# EasyEDA Pro project ProPrj_STM32G431 FOC_2026-07-29.epro, schematic Schematic1
Assembly Variant: Basic; Board Name: Board1; Create Date: 2026-06-18; Page Name: P1; Project Name: STM32G431 FOC; Schematic Name: Schematic1; Update Date: 2026-06-18; Company: 嘉立创EDA; Page Size: A4; Version: V1.0
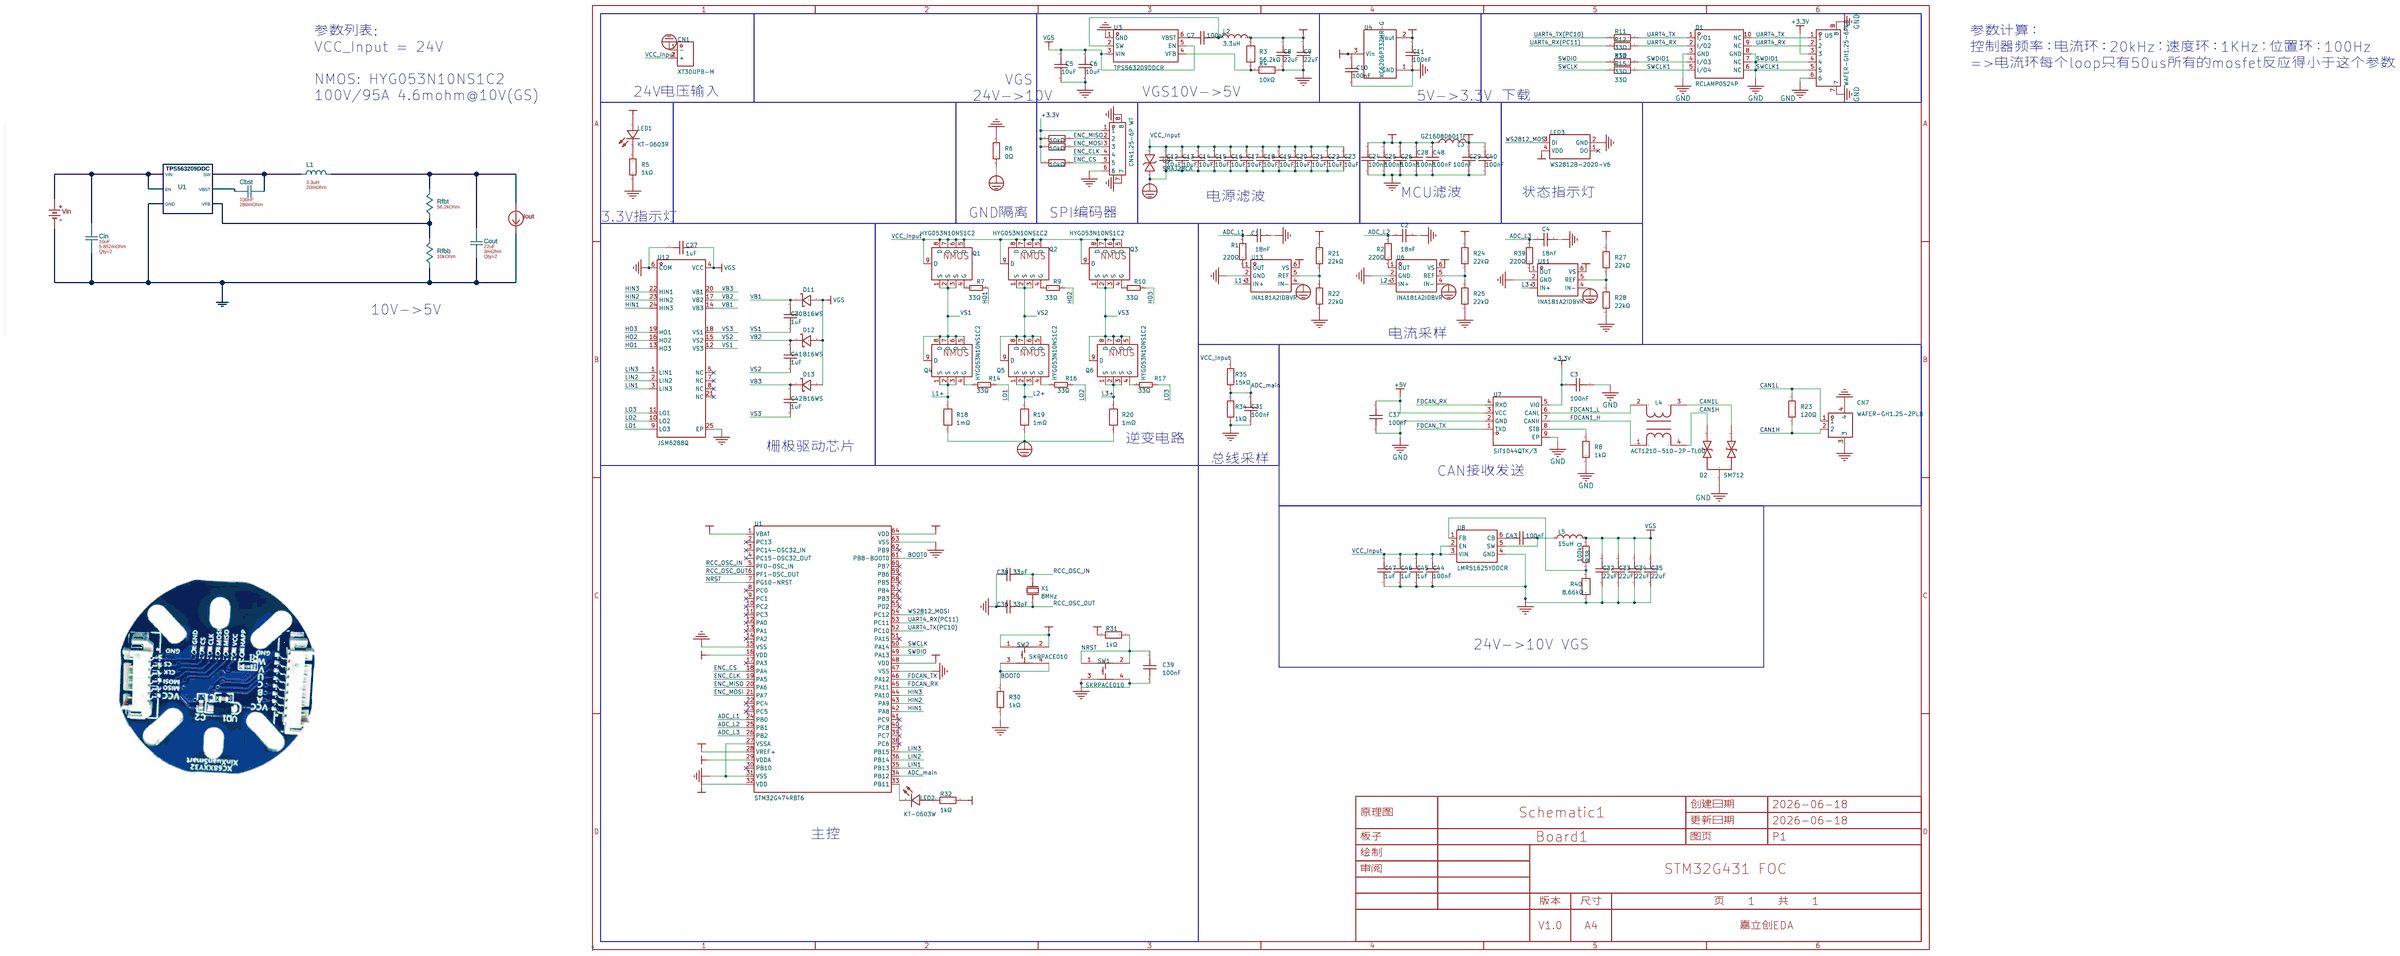
[diagram p0: schematic sheet]

## Parts
C1  18nF  [C0603]
C2  18nF  [C0603]
C3  100nF  [C0603]
C4  18nF  [C0603]
C5  10uF  [C0603]
C6  10uF  [C0603]
C7  100nF  [C0603]
C8  22uF  [C0603]
C9  22uF  [C0603]
C10  100nF  [C0603]
C11  100nF  [C0603]
C12  10uF  [C1206]
C13  10uF  [C1206]
C14  10uF  [C1206]
C15  10uF  [C1206]
C16  10uF  [C1206]
C17  10uF  [C1206]
C18  10uF  [C1206]
C19  10uF  [C1206]
C20  10uF  [C1206]
C21  10uF  [C1206]
C22  10uF  [C1206]
C23  10uF  [C1206]
C24  100nF  [C0603]
C25  100nF  [C0603]
C26  100nF  [C0603]
C27  1uF  [C0603]
C28  100nF  [C0603]
C29  100nF  [C0603]
C30  1uF  [C0603]
C31  100nF  [C0603]
C32  22uF  [C0805]
C33  22uF  [C0805]
C34  22uF  [C0805]
C35  22uF  [C0805]
C36  33pF  [C0603]
C37  100nF  [C0603]
C38  33pF  [C0603]
C39  100nF  [C0603]
C40  100nF  [C0603]
C41  1uF  [C0603]
C42  1uF  [C0603]
C43  100nF  [C0603]
C44  100nF  [C0603]
C45  1uF  [C0603]
C46  1uF  [C0603]
C47  1uF  [C0603]
C48  100nF  [C0603]
CN1  XT30UPB-M  [CONN-TH_XT30UPB-M]
CN4  1.25-6P WT  [CONN-SMD_1.25-6PWT]
CN7  WAFER-GH1.25-2PLB  [CONN-TH_2P-P1.25_XUNPU_WAFER-GH1.25-2PLB]
D1  RCLAMP0524P  [DFN2510-10_L2.5-W1.0-P0.50-BL]
D2  SM712  [SOT-23-3_L2.9-W1.3-P1.90-LS2.4-BR]
D11  B16WS  [SOD-323_L1.8-W1.3-LS2.5-RD]
D12  B16WS  [SOD-323_L1.8-W1.3-LS2.5-RD]
D13  B16WS  [SOD-323_L1.8-W1.3-LS2.5-RD]
L2  3.3uH  [IND-SMD_L4.4-W4.2_SPM4020T]
L3  GZ1608D601TF  [L0603]
L4  ACT1210-510-2P-TL00  [FILTER-SMD_4P-L3.2-W2.5-BL_ACT1210]
L5  15uH  [IND-SMD_L5.7-W5.2_GSM0530]
LED1  KT-0603R  [LED-SMD_L1.6-W0.8-R-RD]
LED2  KT-0603W  [LED0603-R-RD_WHITE]
LED3  WS2812B-2020-V6  [LED-SMD_4P-L2.2-W2.0-P1.00_WS2815C-2020-4P]
Q1  HYG053N10NS1C2  [PDFN-8_L5.8-W5.0-P1.27-LS6.2-BL]
Q2  HYG053N10NS1C2  [PDFN-8_L5.8-W5.0-P1.27-LS6.2-BL]
Q3  HYG053N10NS1C2  [PDFN-8_L5.8-W5.0-P1.27-LS6.2-BL]
Q4  HYG053N10NS1C2  [PDFN-8_L5.8-W5.0-P1.27-LS6.2-BL]
Q5  HYG053N10NS1C2  [PDFN-8_L5.8-W5.0-P1.27-LS6.2-BL]
Q6  HYG053N10NS1C2  [PDFN-8_L5.8-W5.0-P1.27-LS6.2-BL]
R1  220Ω  [R0603]
R2  220Ω  [R0603]
R3  56.2kΩ  [R0603]
R4  10kΩ  [R0603]
R5  1kΩ  [R0603]
R6  0Ω  [R0805]
R7  33Ω  [R0603]
R8  1kΩ  [R0603]
R9  33Ω  [R0603]
R10  33Ω  [R0603]
R11  33Ω  [R0603]
R12  33Ω  [R0603]
R13  33Ω  [R0603]
R14  33Ω  [R0603]
R15  33Ω  [R0603]
R16  33Ω  [R0603]
R17  33Ω  [R0603]
R18  1mΩ  [RES-SMD_L6.3-W3.2_R2512]
R19  1mΩ  [RES-SMD_L6.3-W3.2_R2512]
R20  1mΩ  [RES-SMD_L6.3-W3.2_R2512]
R21  22kΩ  [R0603]
R22  22kΩ  [R0603]
R23  120Ω  [R0603]
R24  22kΩ  [R0603]
R25  22kΩ  [R0603]
R27  22kΩ  [R0603]
R28  22kΩ  [R0603]
R30  1kΩ  [R0603]
R31  1kΩ  [R0603]
R32  1kΩ  [R0603]
R33  10kΩ  [R0603]
R34  1kΩ  [R0603]
R35  15kΩ  [R0603]
R36  10kΩ  [R0603]
R37  10kΩ  [R0603]
R38  100kΩ  [R0603]
R39  220Ω  [R0603]
R40  8.66kΩ  [R0603]
SW1  SKRPACE010  [KEY-SMD_4P-L4.2-W3.2-P2.20-LS4.6]
SW2  SKRPACE010  [KEY-SMD_4P-L4.2-W3.2-P2.20-LS4.6]
U1  STM32G474RBT6  [LQFP-64_L10.0-W10.0-P0.50-LS12.0-BL]
U3  TPS563209DDCR  [SOT-23-6_L2.9-W1.6-P0.95-LS2.8-BR]
U4  XC6206P332MR-G  [SOT-23-3_L2.9-W1.6-P1.90-LS2.8-BR]
U5  WAFER-GH1.25-6PLB  [CONN-SMD_6P-P1.25_XUNPU_WAFER-GH1.25-6PLB]
U6  INA181A2IDBVR  [SOT-23-6_L2.9-W1.6-P0.95-LS2.8-BL]
U7  SIT1044QTK/3  [TDFN-8_L3.0-W3.0-P0.65-BL-EP]
U8  LMR51625YDDCR  [SOT-23-6_L2.9-W1.6-P0.95-LS2.8-BL]
U9  SMAJ28CA  [DO-214AC_L4.3-W2.7-LS5.0-BI]
U11  INA181A2IDBVR  [SOT-23-6_L2.9-W1.6-P0.95-LS2.8-BL]
U12  JSM6288Q  [VQFN-24_L4.0-W4.0-P0.50-TL-EP2.7]
U13  INA181A2IDBVR  [SOT-23-6_L2.9-W1.6-P0.95-LS2.8-BL]
X1  8MHz  [CRYSTAL-SMD_L5.0-W3.2]

## Library data of the parts
C1 C2 C4 = CC0603KRX7R9BB183: 容值:18nF;精度:±10%;额定电压:50V;温度系数:X7R;; LCSC Part Name: 18nF ±10% 50V; Supplier Part: C107079; Manufacturer: YAGEO(国巨); Supplier Footprint: 0603; JLCPCB Part Class: Extended Part; Datasheet: https://item.szlcsc.com/datasheet/CC0603KRX7R9BB183/108295.html; Supplier: LCSC; Tolerance: ±10%; Voltage Rating: 50V; Temperature Coefficient: X7R
C3 C7 C10 C11 C24-C26 C28 C29 C31 C37 C39 C40 C43 C44 C48 = CC0603KRX7R9BB104: 容值:100nF;精度:±10%;额定电压:50V;温度系数:X7R;; LCSC Part Name: 100nF ±10% 50V; Supplier Part: C14663; Manufacturer: YAGEO(国巨); Supplier Footprint: 0603; JLCPCB Part Class: Basic Part; Datasheet: https://item.szlcsc.com/datasheet/CC0603KRX7R9BB104/15331.html; Supplier: LCSC; Tolerance: ±10%; Voltage Rating: 50V; Temperature Coefficient: X7R
C5 C6 = CL10A106MA8NRNC: 容值:10uF;精度:±20%;额定电压:25V;温度系数:X5R;; LCSC Part Name: 10uF ±20% 25V; Supplier Part: C96446; Manufacturer: SAMSUNG(三星); Supplier Footprint: 0603; JLCPCB Part Class: Basic Part; Datasheet: https://item.szlcsc.com/datasheet/CL10A106MA8NRNC/97651.html; Supplier: LCSC; Tolerance: ±20%; Voltage Rating: 25V; Temperature Coefficient: X5R
C8 C9 = CL10A226MQ8NRNC: 容值:22uF;精度:±20%;额定电压:6.3V;温度系数:X5R;; LCSC Part Name: 22uF ±20% 6.3V; Supplier Part: C59461; Manufacturer: SAMSUNG(三星); Supplier Footprint: 0603; JLCPCB Part Class: Basic Part; Datasheet: https://item.szlcsc.com/datasheet/CL10A226MQ8NRNC/60514.html; Supplier: LCSC; Tolerance: ±20%; Voltage Rating: 6.3V; Temperature Coefficient: X5R
C12-C23 = CL31A106KBHNNNE: 容值:10uF;精度:±10%;额定电压:50V;温度系数:X5R;; LCSC Part Name: 10uF ±10% 50V; Supplier Part: C13585; Manufacturer: SAMSUNG(三星); Supplier Footprint: 1206; JLCPCB Part Class: Basic Part; Datasheet: https://item.szlcsc.com/datasheet/CL31A106KBHNNNE/14236.html; Supplier: LCSC; Tolerance: ±10%; Voltage Rating: 50V; Temperature Coefficient: X5R
C27 C30 C41 C42 C45-C47 = CL10A105KB8NNNC: 容值:1uF;精度:±10%;额定电压:50V;温度系数:X5R;; LCSC Part Name: 1uF ±10% 50V; Supplier Part: C15849; Manufacturer: SAMSUNG(三星); Supplier Footprint: 0603; JLCPCB Part Class: Basic Part; Datasheet: https://item.szlcsc.com/datasheet/CL10A105KB8NNNC/16531.html; Supplier: LCSC; Tolerance: ±10%; Voltage Rating: 50V; Temperature Coefficient: X5R
C32-C35 = CGA0805X5R226M250MT: 容值:22uF;精度:±20%;额定电压:25V;温度系数:X5R;; LCSC Part Name: 22uF ±20% 25V; Supplier Part: C6119899; Manufacturer: HRE(芯声); Supplier Footprint: 0805; JLCPCB Part Class: Extended Part; Datasheet: https://item.szlcsc.com/datasheet/CGA0805X5R226M250MT/7062605.html; Supplier: LCSC; Tolerance: ±20%; Voltage Rating: 25V; Temperature Coefficient: X5R
C36 C38 = CL10C330JB8NNNC: 容值:33pF;精度:±5%;额定电压:50V;温度系数:C0G;; LCSC Part Name: 33pF ±5% 50V; Supplier Part: C1663; Manufacturer: SAMSUNG(三星); Supplier Footprint: 0603; JLCPCB Part Class: Basic Part; Datasheet: https://item.szlcsc.com/datasheet/CL10C330JB8NNNC/2015.html; Supplier: LCSC; Tolerance: ±5%; Voltage Rating: 50V; Temperature Coefficient: C0G
CN1 = XT30UPB-M: LCSC Part Name: AMASS(艾迈斯)板载立式 航模锂电池控制器连接器插头 PCB板立式 公头XT30UPB-M.G.Y; Supplier Part: C428721; Manufacturer: AMASS(艾迈斯); JLCPCB Part Class: Extended Part; Datasheet: https://item.szlcsc.com/datasheet/XT30UPB-M/423831.html; Supplier: LCSC; Rated current: 15A; Rated voltage: 500VDC; colour: 黄色; Connector type: 航模插头; contact resistance: 0.65mΩ; interface form: 公头; insulating material: PA; metal material: 镀金
CN4 = 1.25-6P WT: 插针结构:1x6P;间距:1.25mm;安装方式:卧贴;参考系列:PicoBlade(MX 1.25);总PIN数:6P;排数:1;每排PIN数:6;行距:-;额定电流:1A;触头材质:黄铜;触头镀层:锡;工作温度:-25℃~+85℃;; LCSC Part Name: 1.25-6P卧贴编带; Supplier Part: C668617; Manufacturer: SHOU HAN(首韩); Supplier Footprint: SMD,P=1.25mm,卧贴; JLCPCB Part Class: Extended Part; Datasheet: https://item.szlcsc.com/datasheet/1.25-6P%2520WT/698560.html; Supplier: LCSC; Pins Structure: 1x6P; Pitch: 1.25mm; Mounting Type: 卧贴; Reference Series: PicoBlade(MX 1.25); Number of Pins: 6P; Number of Rows: 1; Number of PINs Per Row: 6; Current Rating: 1A; Contact Material: 黄铜; Contact Plating: 锡; Operating Temperature: -25℃~+85℃; Voltage Rating: 125V; Plastic Material: LCP; Flame Retardant Rating: UL94V-0; Color: 米色
CN7 = WAFER-GH1.25-2PLB: 插针结构:1x2P;间距:1.25mm;安装方式:立贴;参考系列:GH;总PIN数:2P;排数:1;每排PIN数:2;额定电流:1A;工作温度范围:-25℃~+85℃;; LCSC Part Name: 1x2P 间距:1.25mm 立贴 系列:GH; Supplier Part: C3029368; Manufacturer: XUNPU(讯普); Supplier Footprint: SMD,P=1.25mm; JLCPCB Part Class: 扩展库; Datasheet: https://atta.szlcsc.com/upload/public/pdf/source/20220527/44F824AAC8C2B617205E15955FF9C23D.pdf; Supplier: LCSC; Pins Structure: 1x2P; Pitch: 1.25mm; Mounting Style: 立贴; Reference Series: GH; Number of Pins: 2P; Number of Rows: 1; Number of PINs Per Row: 2; Current Rating (Max): 1A; Operating Temperature Range: -25℃~+85℃
D1 = RCLAMP0524P_C907837: 极性:单向;反向截止电压(Vrwm):5V;最大钳位电压:17V;峰值脉冲电流(Ipp):4.5A;击穿电压:6.8V;; Supplier Part: C907837; Manufacturer: TECH PUBLIC(台舟); Supplier Footprint: DFN2510-10; JLCPCB Part Class: 扩展库; Datasheet: https://atta.szlcsc.com/upload/public/pdf/source/20210810/AE3DE9AC94AD2A317FD9BEA10653400F.pdf; Supplier: LCSC; polarity: 单向; Reverse Stand-Off Voltage (Vrwm): 5V; Maximum Clamping Voltage: 17V; Peak Pulse Current (Ipp): 4.5A; Breakdown Voltage: 6.8V; Reverse Leakage Current (Ir): 80nA; Number of Lines: 四路; Operating Temperature: -55℃~+125℃; level of protection: IEC 61000-4-2; Type: ESD
D2 = SM712_C521963: 极性:双向;反向截止电压(Vrwm):12V；7V;最大钳位电压:15V；25V;峰值脉冲电流(Ipp):7A;峰值脉冲功率(Ppp):150W;击穿电压:7.5V；13.3V;; Supplier Part: C521963; Manufacturer: TECH PUBLIC(台舟); Supplier Footprint: SOT-23; JLCPCB Part Class: 扩展库; Datasheet: https://atta.szlcsc.com/upload/public/pdf/source/20210810/E76C7C1824B0CB2A5B8963B3ABCE2DCE.pdf; Supplier: LCSC; polarity: 双向; Reverse Stand-Off Voltage (Vrwm): 12V；7V; Maximum Clamping Voltage: 15V；25V; Peak Pulse Current (Ipp): 7A; Peak Pulse Power Dissipation (Ppp): 150W; Breakdown Voltage: 7.5V；13.3V; Reverse Leakage Current (Ir): 500nA；10nA; Number of Lines: 双路; Operating Temperature: -55℃~+125℃; level of protection: IEC 61000-4-2; Type: ESD
D11-D13 = B16WS_C364278: Supplier Part: C364278; Manufacturer: MDD; Supplier Footprint: SOD-323; JLCPCB Part Class: Extended Part; Datasheet: https://atta.szlcsc.com/upload/public/pdf/source/20190125/C364278_08C9E980565605CB111C36D3361AA1D7.pdf; Supplier: LCSC
L2 = PCR0420-3R3-M: 电感值:3.3uH;精度:±20%;额定电流:2.5A;饱和电流(Isat):3.5A;类型:一体成型电感;; LCSC Part Name: 3.3μH ±20% 3.5A; Supplier Part: C53896857; Manufacturer: JIERR(捷而瑞); Supplier Footprint: SMD,4.4x4.1mm; JLCPCB Part Class: Extended Part; Datasheet: https://item.szlcsc.com/datasheet/PCR0420-3R3-M/57092539.html; Supplier: LCSC; Tolerance: ±20%; Current Rating: 2.5A; Current - Saturation(Isat): 3.5A; DC Resistance(DCR): 85mΩ; Type: 一体成型电感
L3 = GZ1608D601TF: 标称阻抗@测试频率:600Ω@100MHz;误差:±25%;直流电阻(RDC):450mΩ;; LCSC Part Name: 单路 0603磁珠 阻抗600Ω@100MHz; Supplier Part: C1002; Manufacturer: Sunlord(顺络); Supplier Footprint: 0603; JLCPCB Part Class: 基础库; Datasheet: https://atta.szlcsc.com/upload/public/pdf/source/20231030/9B6A3E87682CEC1FF6638DFAA81D73FA.pdf; Supplier: LCSC; Impedance @ Frequency: 600Ω@100MHz; Tolerance: ±25%; DC Resistance: 450mΩ; Current Rating: 200mA; Circuits: 1
L4 = ACT1210-510-2P-TL00: 线路数:2;电感 @ 频率:51uH@100kHz;阻抗 @ 频率:2.6kΩ@10MHz;直流电阻(DCR):700mΩ;; LCSC Part Name: 两路 共模滤波器 阻抗2.6kΩ@10MHz; Supplier Part: C95572; Manufacturer: TDK; Supplier Footprint: 3.2x2.5mm; JLCPCB Part Class: 扩展库; Datasheet: https://atta.szlcsc.com/upload/public/pdf/source/20171113/C95572_15105616815011116176.pdf; Supplier: LCSC; Number of Lines: 2; Current Rating: 200mA; Inductance @ Frequency: 51uH@100kHz; Voltage Rating - DC: 80V; Impedance @ Frequency: 2.6kΩ@10MHz; DC Resistance (DCR): 700mΩ; Operating Temperature: -55℃~+150℃
L5 = SRG0530-150-M: 电感值:15uH;精度:±20%;额定电流:2.5A;饱和电流(Isat):3A;类型:一体成型电感;; LCSC Part Name: 15μH ±20% 3A; Supplier Part: C53462979; Manufacturer: JIERR(捷而瑞); Supplier Footprint: SMD,5.7x5.2mm; JLCPCB Part Class: Extended Part; Datasheet: https://item.szlcsc.com/datasheet/SRG0530-150-M/56628174.html; Supplier: LCSC; Tolerance: ±20%; Current Rating: 2.5A; Current - Saturation(Isat): 3A; DC Resistance(DCR): 218mΩ; Type: 一体成型电感
LED1 = KT-0603R: 灯头类型:-;发光颜色:红色;正向压降(Vf):1.8V~2.4V;功率:40mW;正向电流:20mA;波长:615nm~630nm;二极管配置:独立二极管;透镜颜色:无色透明透镜;色温:-;发光强度:300mcd;发光角度:120°;载带方式:-;工作温度:-40℃~+85℃;; LCSC Part Name: 0603 红灯 高亮; Supplier Part: C2286; Manufacturer: KENTO; Supplier Footprint: 0603; JLCPCB Part Class: Basic Part; Datasheet: https://item.szlcsc.com/datasheet/KT-0603R/2659.html; Supplier: LCSC; Illumination Color: 红色; Voltage - Forward(Vf): 1.8V~2.4V; Power(Watts): 40mW; Forward Current: 20mA; Wavelength - Dominant: 615nm~630nm; Peak Wavelength: 645nm; Diode Configuration: 独立二极管; Lens Color: 无色透明透镜; Luminous Intensity: 300mcd; Viewing Angle: 120°; Operating Temperature: -40℃~+85℃
LED2 = KT-0603W: 发光颜色:白色;; LCSC Part Name: 0603 白灯 高亮; Supplier Part: C2290; Manufacturer: KENTO; Supplier Footprint: 0603; JLCPCB Part Class: 基础库; Datasheet: https://atta.szlcsc.com/upload/public/pdf/source/20221101/4C23D5C85BA051E44A00B833D0A41468.pdf; Supplier: LCSC; Emitted Color: 白色
LED3 = WS2812B-2020-V6: Supplier Part: C52917434; Manufacturer: worldsemi; Supplier Footprint: SMD2020-4P; JLCPCB Part Class: Extended Part; Datasheet: https://item.szlcsc.com/datasheet/WS2812B-2020-V6/55827425.html; Supplier: LCSC
Q1-Q6 = HYG053N10NS1C2: 数量:1个N沟道;漏源电压(Vdss):100V;连续漏极电流(Id):95A;导通电阻(RDS(on)):5.3mΩ@10V;耗散功率(Pd):83.3W;阈值电压(Vgs(th)):4V@250uA;; LCSC Part Name: N沟道增强型MOSFET 1个N沟道 耐压:100V 电流:95A; Supplier Part: C2986239; Manufacturer: HUAYI(华羿微); Supplier Footprint: PDFN5x6-8L; JLCPCB Part Class: Extended Part; Datasheet: https://item.szlcsc.com/datasheet/HYG053N10NS1C2/3433327.html; Supplier: LCSC; Number: 1个N沟道; Drain to Source Voltage: 100V; Current - Continuous Drain(Id): 95A; RDS(on): 5.3mΩ@10V; Pd - Power Dissipation: 83.3W; Gate Threshold Voltage (Vgs(th)): 4V@250uA; Gate Charge(Qg): 73nC@10V; Input Capacitance(Ciss): 3.744nF; Reverse Transfer Capacitance (Crss@Vds): 153pF; Operating Temperature: -55℃~+175℃; Type: N沟道; Output Capacitance(Coss): 1.342nF
R1 R2 R39 = 0603WAF2200T5E: 电阻类型:厚膜电阻;阻值:220Ω;精度:±1%;功率:100mW;最大工作电压:75V;温度系数:±100ppm/℃;; LCSC Part Name: 220Ω ±1% 100mW 厚膜电阻; Supplier Part: C22962; Manufacturer: UNI-ROYAL(厚声); Supplier Footprint: 0603; JLCPCB Part Class: Basic Part; Datasheet: https://atta.szlcsc.com/upload/public/pdf/source/20200306/C422600_1E6D84923E4A46A82E41ADD87F860B5C.pdf; Supplier: LCSC; Type: 厚膜电阻; Tolerance: ±1%; Power(Watts): 100mW; Overload Voltage (Max): 75V; Temperature Coefficient: ±100ppm/℃; Operating Temperature Range: -55℃~+155℃
R3 = RT0603BRD0756K2L: 电阻类型:薄膜电阻;阻值:56.2kΩ;精度:±0.1%;功率:100mW;工作电压:75V;温度系数:±25ppm/℃;; LCSC Part Name: 薄膜电阻 56.2kΩ ±0.1% 100mW; Supplier Part: C705784; Manufacturer: YAGEO(国巨); Supplier Footprint: 0603; JLCPCB Part Class: Extended Part; Datasheet: https://item.szlcsc.com/datasheet/RT0603BRD0756K2L/742304.html; Supplier: LCSC; Type: 薄膜电阻; Tolerance: ±0.1%; Power(Watts): 100mW; Voltage-Supply(Max): 75V; Temperature Coefficient: ±25ppm/℃; Operating Temperature: -55℃~+155℃
R4 R33 R36 R37 = 0603WAF1002T5E: 电阻类型:厚膜电阻;阻值:10kΩ;精度:±1%;功率:100mW;工作电压:75V;温度系数:±100ppm/℃;; LCSC Part Name: 厚膜电阻 10kΩ ±1% 100mW; Supplier Part: C25804; Manufacturer: UNI-ROYAL(厚声); Supplier Footprint: 0603; JLCPCB Part Class: Basic Part; Datasheet: https://item.szlcsc.com/datasheet/0603WAF1002T5E/26547.html; Supplier: LCSC; Type: 厚膜电阻; Tolerance: ±1%; Power(Watts): 100mW; Voltage-Supply(Max): 75V; Temperature Coefficient: ±100ppm/℃; Operating Temperature: -55℃~+155℃
R5 R8 R30-R32 R34 = 0603WAF1001T5E: 电阻类型:厚膜电阻;阻值:1kΩ;精度:±1%;功率:100mW;最大工作电压:75V;温度系数:±100ppm/℃;; LCSC Part Name: 1kΩ ±1% 100mW 厚膜电阻; Supplier Part: C21190; Manufacturer: UNI-ROYAL(厚声); Supplier Footprint: 0603; JLCPCB Part Class: Basic Part; Datasheet: https://atta.szlcsc.com/upload/public/pdf/source/20200306/C422600_1E6D84923E4A46A82E41ADD87F860B5C.pdf; Supplier: LCSC; Type: 厚膜电阻; Tolerance: ±1%; Power(Watts): 100mW; Overload Voltage (Max): 75V; Temperature Coefficient: ±100ppm/℃; Operating Temperature Range: -55℃~+155℃
R6 = 0805W8F0000T5E: 电阻类型:厚膜电阻;阻值:0Ω;精度:±1%;功率:125mW;工作电压:150V;温度系数:±800ppm/℃;; LCSC Part Name: 0Ω ±1% 125mW 厚膜电阻; Supplier Part: C17477; Manufacturer: UNI-ROYAL(厚声); Supplier Footprint: 0805; JLCPCB Part Class: Basic Part; Datasheet: https://item.szlcsc.com/datasheet/0805W8F0000T5E/18165.html; Supplier: LCSC; Type: 厚膜电阻; Tolerance: ±1%; Power(Watts): 125mW; Voltage-Supply(Max): 150V; Temperature Coefficient: ±800ppm/℃; Operating Temperature: -55℃~+155℃
R7 R9 R10 R14 R16 R17 = 0603WAF220JT5E: 阻值:22Ω;精度:±1%;功率:100mW;温度系数:±100ppm/℃;电阻类型:厚膜电阻;; LCSC Part Name: 22Ω ±1% 100mW 厚膜电阻; Supplier Part: C23345; Manufacturer: UNI-ROYAL(厚声); Supplier Footprint: 0603; JLCPCB Part Class: Basic Part; Datasheet: https://atta.szlcsc.com/upload/public/pdf/source/20200306/C422600_1E6D84923E4A46A82E41ADD87F860B5C.pdf; Supplier: LCSC; Tolerance: ±1%; Power(Watts): 100mW; Overload Voltage (Max): 75V; Temperature Coefficient: ±100ppm/℃; Type: 厚膜电阻; Operating Temperature Range: -55℃~+155℃; Pin Type: IN; Check: true
R11-R13 R15 = 0603WAF330JT5E: 电阻类型:厚膜电阻;阻值:33Ω;精度:±1%;功率:100mW;工作电压:75V;温度系数:±100ppm/℃;; LCSC Part Name: 33Ω ±1% 100mW 厚膜电阻; Supplier Part: C23140; Manufacturer: UNI-ROYAL(厚声); Supplier Footprint: 0603; JLCPCB Part Class: Basic Part; Datasheet: https://item.szlcsc.com/datasheet/0603WAF330JT5E/23867.html; Supplier: LCSC; Type: 厚膜电阻; Tolerance: ±1%; Power(Watts): 100mW; Voltage-Supply(Max): 75V; Temperature Coefficient: ±100ppm/℃; Operating Temperature: -55℃~+155℃
R18-R20 = RE2512F3R001: 电阻类型:采样电阻；合金电阻;阻值:1mΩ;精度:±1%;功率:3W;温度系数:±50ppm/℃;; LCSC Part Name: 1mΩ 3W 2512 ±1%; Supplier Part: C46961745; Manufacturer: JIERR(捷而瑞); Supplier Footprint: 2512; JLCPCB Part Class: Extended Part; Datasheet: https://item.szlcsc.com/datasheet/RE2512F3R001/49133284.html; Supplier: LCSC; Type: 采样电阻；合金电阻; Tolerance: ±1%; Power(Watts): 3W; Temperature Coefficient: ±50ppm/℃
R21 R22 R24 R25 R27 R28 = 0603WAF2202T5E: 电阻类型:厚膜电阻;阻值:22kΩ;精度:±1%;功率:100mW;工作电压:75V;温度系数:±100ppm/℃;; LCSC Part Name: 22kΩ ±1% 100mW 厚膜电阻; Supplier Part: C31850; Manufacturer: UNI-ROYAL(厚声); Supplier Footprint: 0603; JLCPCB Part Class: Basic Part; Datasheet: https://item.szlcsc.com/datasheet/0603WAF2202T5E/32812.html; Supplier: LCSC; Type: 厚膜电阻; Tolerance: ±1%; Power(Watts): 100mW; Voltage-Supply(Max): 75V; Temperature Coefficient: ±100ppm/℃; Operating Temperature: -55℃~+155℃
R23 = 0603WAF1200T5E: 电阻类型:厚膜电阻;阻值:120Ω;精度:±1%;功率:100mW;工作电压:75V;温度系数:±100ppm/℃;; LCSC Part Name: 120Ω ±1% 100mW 厚膜电阻; Supplier Part: C22787; Manufacturer: UNI-ROYAL(厚声); Supplier Footprint: 0603; JLCPCB Part Class: Basic Part; Datasheet: https://item.szlcsc.com/datasheet/0603WAF1200T5E/23514.html; Supplier: LCSC; Type: 厚膜电阻; Tolerance: ±1%; Power(Watts): 100mW; Voltage-Supply(Max): 75V; Temperature Coefficient: ±100ppm/℃; Operating Temperature: -55℃~+155℃
R35 = 0603WAF1502T5E: 电阻类型:厚膜电阻;阻值:15kΩ;精度:±1%;功率:100mW;工作电压:75V;温度系数:±100ppm/℃;; LCSC Part Name: 15kΩ ±1% 100mW 厚膜电阻; Supplier Part: C22809; Manufacturer: UNI-ROYAL(厚声); Supplier Footprint: 0603; JLCPCB Part Class: Basic Part; Datasheet: https://item.szlcsc.com/datasheet/0603WAF1502T5E/23536.html; Supplier: LCSC; Type: 厚膜电阻; Tolerance: ±1%; Power(Watts): 100mW; Voltage-Supply(Max): 75V; Temperature Coefficient: ±100ppm/℃; Operating Temperature: -55℃~+155℃
R38 = 0603WAF1003T5E: 电阻类型:厚膜电阻;阻值:100kΩ;精度:±1%;功率:100mW;工作电压:75V;温度系数:±100ppm/℃;; LCSC Part Name: 100kΩ ±1% 100mW 厚膜电阻; Supplier Part: C25803; Manufacturer: UNI-ROYAL(厚声); Supplier Footprint: 0603; JLCPCB Part Class: Basic Part; Datasheet: https://item.szlcsc.com/datasheet/0603WAF1003T5E/26546.html; Supplier: LCSC; Type: 厚膜电阻; Tolerance: ±1%; Power(Watts): 100mW; Voltage-Supply(Max): 75V; Temperature Coefficient: ±100ppm/℃; Operating Temperature: -55℃~+155℃
R40 = FRC0603F8661TS: 电阻类型:厚膜电阻;阻值:8.66kΩ;精度:±1%;功率:100mW;工作电压:75V;温度系数:±100ppm/℃;; LCSC Part Name: 8.66kΩ ±1% 100mW 厚膜电阻; Supplier Part: C3000724; Manufacturer: FOJAN(富捷); Supplier Footprint: 0603; JLCPCB Part Class: Extended Part; Supplier: LCSC; Type: 厚膜电阻; Tolerance: ±1%; Power(Watts): 100mW; Voltage-Supply(Max): 75V; Temperature Coefficient: ±100ppm/℃; Operating Temperature: -55℃~+155℃
SW1 SW2 = SKRPACE010: 电路结构:单刀单掷;按钮形状:椭圆形按钮;安装方式:立贴;开关长度:4.2mm;开关宽度:3.2mm;开关高度:2.5mm;触点电流:50mA;额定电压:16V;带灯:-;工作寿命:-;; LCSC Part Name: 4.2*3.2*2.5mm 立贴 轻触开关; Supplier Part: C139797; Manufacturer: ALPSALPINE(阿尔卑斯阿尔派); Supplier Footprint: SMD-4P,4.2x3.2mm; JLCPCB Part Class: Extended Part; Datasheet: https://item.szlcsc.com/datasheet/SKRPACE010/151122.html; Supplier: LCSC; Circuit: 单刀单掷; Actuator Style: 椭圆形按钮; Mounting Type: 立贴; Length: 4.2mm; Width: 3.2mm; Switch Height: 2.5mm; Contact Current: 50mA; Voltage Rating: 16V
U1 = STM32G474RBT6: CPU内核:ARM-M4;CPU最大主频:170MHz;应用领域:-;; LCSC Part Name: 带DSP和FPU的170MHz主流ARM Cortex-M4 MCU，具有128 KB Flash存储器、数学加速器、高分辨率定时器和高模拟电平集成; Supplier Part: C529413; Manufacturer: ST(意法半导体); Supplier Footprint: LQFP-64(10x10); JLCPCB Part Class: Extended Part; Datasheet: https://item.szlcsc.com/datasheet/STM32G474RBT6/549641.html; Supplier: LCSC; CPU Core: ARM-M4; CPU Maximum Speed: 170MHz; Program Storage Size: 128KB; Program Memory Type: FLASH; Number of I/O: 52; ADC (Bit): 12bit; DAC (Bit): 12bit; Voltage - Supply: 1.71V~3.6V
U3 = TPS563209DDCR: 功能类型:降压型;工作电压:4.5V~17V;输出电压:760mV~7V;输出电流:3A;输出类型:可调;; LCSC Part Name: 降压型 3A 4.5V~17V; Supplier Part: C181974; Manufacturer: TI(德州仪器); Supplier Footprint: SOT-23-6; JLCPCB Part Class: Extended Part; Datasheet: https://www.ti.com/cn/lit/gpn/tps563209; Supplier: LCSC; Function: 降压型; Voltage - Supply: 4.5V~17V; Output Voltage: 760mV~7V; Output Current: 3A; Frequency - Switching: 650kHz; Operating Temperature: -40℃~+85℃@(TA); Synchronous Rectifier: 是; Number of Outputs: 1; Topology: 降压式; Quiescent Current: 650uA; Switch tube (built-in/external): 内置; Output Type: 可调; Features: 逐波限流；过流保护；打嗝限流
U4 = XC6206P332MR-G_C5446: 输出类型:固定;工作电压:6V;输出电压:3.3V;输出电流:200mA;电源纹波抑制比(PSRR):-;输出极性:正极;; LCSC Part Name: 3.3V 200mA 6V; Supplier Part: C5446; Manufacturer: TOREX(特瑞仕); Supplier Footprint: SOT-23-3L; JLCPCB Part Class: Basic Part; Datasheet: https://item.szlcsc.com/datasheet/XC6206P332MR-G/5896.html; Supplier: LCSC; Output Type: 固定; Voltage - Supply: 6V; Output Voltage: 3.3V; Output Current: 200mA; standby current: 1uA; Features: 过流保护; Operating Temperature: -40℃~+85℃@(Ta); Output Configuration: 正极; Number of Outputs: 1
U5 = WAFER-GH1.25-6PLB: 插针结构:1x6P;间距:1.25mm;安装方式:立贴;参考系列:GH;总PIN数:6P;排数:1;每排PIN数:6;额定电流:1A;工作温度范围:-25℃~+85℃;; LCSC Part Name: 1x6P 间距:1.25mm 立贴 系列:GH; Supplier Part: C3029372; Manufacturer: XUNPU(讯普); Supplier Footprint: SMD,P=1.25mm; JLCPCB Part Class: 扩展库; Datasheet: https://atta.szlcsc.com/upload/public/pdf/source/20220527/44F824AAC8C2B617205E15955FF9C23D.pdf; Supplier: LCSC; Pins Structure: 1x6P; Pitch: 1.25mm; Mounting Style: 立贴; Reference Series: GH; Number of Pins: 6P; Number of Rows: 1; Number of PINs Per Row: 6; Current Rating (Max): 1A; Operating Temperature Range: -25℃~+85℃
U6 U11 U13 = INA181A2IDBVR: 放大器数:单路;共模电压:-200mV~26V;增益:50V/V;带宽:210kHz;; Supplier Part: C2058784; Manufacturer: TI(德州仪器); Supplier Footprint: SOT-23-6; JLCPCB Part Class: Extended Part; Datasheet: https://www.ti.com/cn/lit/gpn/ina4181; Supplier: LCSC; Number of Channels: 单路; Vcm - Common Mode Voltage: -200mV~26V; Gain: 50V/V; Bandwidth: 210kHz; Ib - Input Bias Current: 6uA; Vos - Input Offset Voltage: 25uV; Operating Temperature: -40℃~+125℃; Differential Voltage: -26V~+26V; Single Supply: 2.7V~5.5V; Quiescent Current: 195uA; Output Current: 8mA; Input Offset Voltage Drift(Vos TC): 1uV/℃; Input Offset Current(Ios): 0.05uA; Slew Rate: 2V/us; Common Mode Rejection Ratio (CMRR): 100dB; Noise density(eN): 40nV/√Hz@1kHz
U7 = SIT1044QTK/3: 类型:CAN-FD收发器;数据速率:5Mbps;; Supplier Part: C5308063; Manufacturer: SIT(芯力特); Supplier Footprint: DFN-8(3x3); JLCPCB Part Class: 扩展库; Datasheet: https://atta.szlcsc.com/upload/public/pdf/source/20241105/7D4F6AF505B38E348F613F026F5787F9.pdf; Supplier: LCSC; Type: CAN-FD收发器; Data Rate: 5Mbps; Supply Voltage: 4.75V~5.25V; Operating Temperature: -40℃~+125℃
U8 = LMR51625YDDCR: 功能类型:降压型;工作电压:4.3V~60V;输出电压:800mV~30V;输出电流:2.5A;输出类型:可调;; LCSC Part Name: 降压型 2.5A 4.3V~60V; Supplier Part: C44991044; Manufacturer: TI(德州仪器); Supplier Footprint: SOT-23-6; JLCPCB Part Class: Extended Part; Datasheet: https://www.ti.com.cn/cn/lit/ds/symlink/lmr51625.pdf; Supplier: LCSC; Function: 降压型; Voltage - Supply: 4.3V~60V; Output Voltage: 800mV~30V; Output Current: 2.5A; Frequency - Switching: 1.1MHz; Operating Temperature: -40℃~+150℃@(TJ); Synchronous Rectifier: 是; Topology: 降压式; Quiescent Current: 29uA; Switch tube (built-in/external): 内置; Output Type: 可调
U9 = SMAJ28CA_C19077546: 极性:双向;反向截止电压(Vrwm):28V;钳位电压:45.4V;峰值脉冲电流(Ipp):8.8A;峰值脉冲功率(Ppp):400W@10/1000us;击穿电压:34.4V;; LCSC Part Name: 双向TVS 28V截止 峰值浪涌电流：8.8A; Supplier Part: C19077546; Manufacturer: R+O(宏嘉诚); Supplier Footprint: DO-214AC(SMA); JLCPCB Part Class: Extended Part; Datasheet: https://item.szlcsc.com/datasheet/SMAJ28CA/20275631.html; Supplier: LCSC; Polarity: 双向; Reverse Stand-Off Voltage (Vrwm): 28V; Clamping Voltage: 45.4V; Peak Pulse Current (Ipp): 8.8A; Peak Pulse Power Dissipation (Ppp): 400W@10/1000us; Voltage - Breakdown: 34.4V; Reverse Leakage Current (Ir): 1uA; Operating Temperature: -55℃~+150℃; level of protection: IEC 61000-4-2; Type: TVS
U12 = JSM6288Q: 驱动配置:高边；低边；三相;负载类型:MOSFET;驱动通道数:-;灌电流(IOL):1.8A;拉电流(IOH):1.5A;工作电压:8V~20V;上升时间(tr):30ns;下降时间(tf):30ns;; LCSC Part Name: 250V三相高低侧功率驱动芯片 高低侧同相 步进/伺服电机、电动工具等兼容FD6288Q.; Supplier Part: C19077370; Manufacturer: JSMSEMI(杰盛微); Supplier Footprint: QFN-24; JLCPCB Part Class: Extended Part; Datasheet: https://item.szlcsc.com/datasheet/JSM6288Q/20275147.html; Supplier: LCSC; Driven Configuration: 高边；低边；三相; Load Type: MOSFET; Current - Output Low(IOL): 1.8A; Current - Output High(IOH): 1.5A; Voltage - Supply: 8V~20V; Rise Time: 30ns; Fall Time: 30ns; Features: 欠压保护(UVP); Operating Temperature: -40℃~+125℃; Quiescent Current(Iq): 230uA
X1 = X50328MSB2GI: 晶振类型:贴片晶振;频率:8MHz;常温频差:±10ppm;负载电容:20pF;频率稳定度:±20ppm;; LCSC Part Name: YSX530GA 8MHZ 2P 5032 20PF ±10PPM -40~85℃ (±20PPM); Supplier Part: C115962; Manufacturer: YXC(扬兴晶振); Supplier Footprint: SMD5032-2P; JLCPCB Part Class: Basic Part; Datasheet: https://item.szlcsc.com/datasheet/X50328MSB2GI/117214.html; Supplier: LCSC; Type: 贴片晶振; Normal temperature Frequency Tolerance: ±10ppm; Load Capacitance: 20pF; Frequency Stability: ±20ppm; Operating Temperature: -40℃~+85℃

## Nets
+3.3V: C3.2 C11.2 C24.2 C25.2 C26.2 C28.2 C48.2 CN4.1 L3.1 LED1.1(A) R21.2 R24.2 R27.2 R31.2 R32.1 R33.1 R36.1 R37.1 SW2.1 SW2.2 U1.1(VBAT) U1.16(VDD) U1.32(VDD) U1.48(VDD) U1.64(VDD) U4.2(Vout) U5.3 U6.6(VS) U7.5(VIO) U11.6(VS) U13.6(VS)
+5V: C8.2 C9.2 C10.2 C37.2 L2.2 LED3.4(VDD) R3.2 U4.3(Vin) U7.3(VCC)
GND: C1.2 C2.2 C3.1 C4.2 C5.1 C6.1 C8.1 C9.1 C10.1 C11.1 C24.1 C25.1 C26.1 C27.1 C28.1 C29.1 C31.1 C32.1 C33.1 C34.2 C35.2 C36.1 C37.1 C38.1 C39.1 C40.1 C44.1 C45.2 C46.2 C47.2 C48.1 CN4.6 CN4.7 CN4.8 CN7.3 CN7.4 D1.3(GND) D1.8(GND) D2.3 LED3.2(GND) R4.1 R5.1 R6.2 R8.2 R22.1 R25.1 R28.1 R30.2 R34.1 R40.1 SW1.3 SW1.4 U1.15(VSS) U1.27(VSSA) U1.31(VSS) U1.47(VSS) U1.63(VSS) U3.1(GND) U4.1(GND) U5.6 U5.7 U5.8 U6.2(GND) U7.2(GND) U7.9(EP) U8.4(GND) U11.2(GND) U12.6(COM) U12.25(EP) U13.2(GND)
PGND: C12.1 C13.1 C14.1 C15.1 C16.1 C17.1 C18.1 C19.1 C20.1 C21.1 C22.1 C23.1 CN1.1(-) R6.1 R18.1 R19.1 R20.1 U6.4(IN-) U9.1 U11.4(IN-) U13.4(IN-)
VCC_Input: C12.2 C13.2 C14.2 C15.2 C16.2 C17.2 C18.2 C19.2 C20.2 C21.2 C22.2 C23.2 C44.2 C45.1 C46.1 C47.1 CN1.2(+) Q1.5(D) Q1.6(D) Q1.7(D) Q1.8(D) Q1.9(D) Q2.5(D) Q2.6(D) Q2.7(D) Q2.8(D) Q2.9(D) Q3.5(D) Q3.6(D) Q3.7(D) Q3.8(D) Q3.9(D) R35.2 U8.2(EN) U8.3(VIN) U9.2
VDDA: C29.2 C40.2 L3.2 U1.28(VREF+) U1.29(VDDA)
ADC_L1: C1.1 R1.2 U1.24(PB0)
ADC_L2: C2.1 R2.1 U1.25(PB1)
ADC_L3: C4.1 R39.2 U1.26(PB2)
ADC_main: C31.2 R34.2 R35.1 U1.34(PB12)
BOOT0: R30.1 SW2.3 SW2.4 U1.61(PB8-BOOT0)
CAN1H: CN7.2 D2.2 L4.4 R23.1
CAN1L: CN7.1 D2.1 L4.3 R23.2
ENC_CLK: CN4.4 U1.19(PA5)
ENC_CS: CN4.5 R37.2 U1.18(PA4)
ENC_MISO: CN4.2 R33.2 U1.20(PA6)
ENC_MOSI: CN4.3 R36.2 U1.21(PA7)
FDCAN1_H: L4.1 U7.7(CANH)
FDCAN1_L: L4.2 U7.6(CANL)
FDCAN_RX: U1.45(PA11) U7.4(RXD)
FDCAN_TX: U1.46(PA12) U7.1(TXD)
HIN1: U1.42(PA8) U12.24(HIN3)
HIN2: U1.43(PA9) U12.23(HIN2)
HIN3: U1.44(PA10) U12.22(HIN1)
HO1: R7.2 U12.13(HO3)
HO2: R9.2 U12.16(HO2)
HO3: R10.2 U12.19(HO1)
L1+: Q4.1(S) Q4.2(S) Q4.3(S) R18.2 U13.3(IN+)
L2+: Q5.1(S) Q5.2(S) Q5.3(S) R19.2 U6.3(IN+)
L3+: Q6.1(S) Q6.2(S) Q6.3(S) R20.2 U11.3(IN+)
LIN1: U1.35(PB13) U12.3(LIN3)
LIN2: U1.36(PB14) U12.2(LIN2)
LIN3: U1.37(PB15) U12.1(LIN1)
LO1: R14.2 U12.9(LO3)
LO2: R16.2 U12.10(LO2)
LO3: R17.2 U12.11(LO1)
NRST: C39.2 R31.1 SW1.1 SW1.2 U1.7(PG10-NRST)
RCC_OSC_IN: C38.2 U1.5(PF0-OSC_IN) X1.2(OSC2)
RCC_OSC_OUT: C36.2 U1.6(PF1-OSC_OUT) X1.1(OSC1)
SWCLK: R15.1 U1.50(PA14)
SWCLK1: D1.5(I/O4) D1.6(NC) R15.2 U5.5
SWDIO: R13.1 U1.49(PA13)
SWDIO1: D1.4(I/O3) D1.7(NC) R13.2 U5.4
UART4_RX: D1.2(I/O2) D1.9(NC) R12.2 U5.2
UART4_RX(PC11): R12.1 U1.53(PC11)
UART4_TX: D1.1(I/O1) D1.10(NC) R11.2 U5.1
UART4_TX(PC10): R11.1 U1.52(PC10)
VB1: C30.2 D11.1 U12.14(VB3)
VB2: C41.2 D12.1 U12.17(VB2)
VB3: C42.2 D13.1 U12.20(VB1)
VGS: C5.2 C6.2 C27.2 C32.2 C33.2 C34.1 C35.1 D11.2 D12.2 D13.2 L5.2 R38.1 U3.3(VIN) U3.5(EN) U12.4(VCC)
VS1: C30.1 Q1.1(S) Q1.2(S) Q1.3(S) Q4.5(D) Q4.6(D) Q4.7(D) Q4.8(D) Q4.9(D) U12.12(VS3)
VS2: C41.1 Q2.1(S) Q2.2(S) Q2.3(S) Q5.5(D) Q5.6(D) Q5.7(D) Q5.8(D) Q5.9(D) U12.15(VS2)
VS3: C42.1 Q3.1(S) Q3.2(S) Q3.3(S) Q6.5(D) Q6.6(D) Q6.7(D) Q6.8(D) Q6.9(D) U12.18(VS1)
WS2812_MOSI: LED3.3(DI) U1.54(PC12)
$1N49: C7.1 U3.6(VBST)
$1N50: C7.2 L2.1 U3.2(SW)
$1N52: R3.1 R4.2 U3.4(VFB)
$1N77: LED1.2(K) R5.2
$1N164: Q1.4(G) R7.1
$1N166: Q2.4(G) R9.1
$1N168: Q3.4(G) R10.1
$1N170: Q4.4(G) R14.1
$1N172: Q5.4(G) R16.1
$1N174: Q6.4(G) R17.1
$1N184: R21.1 R22.2 U13.5(REF)
$1N200: R24.1 R25.2 U6.5(REF)
$1N210: R27.1 R28.2 U11.5(REF)
$1N250: LED2.2(K) U1.33(PB11)
$1N251: LED2.1(A) R32.2
$1N369: R8.1 U7.8(STB)
$1N380: C43.2 U8.6(CB)
$1N382: R38.2 R40.2 U8.1(FB)
$1N383: C43.1 L5.1 U8.5(SW)
$1N387: R1.1 U13.1(OUT)
$1N389: R2.2 U6.1(OUT)
$1N391: R39.1 U11.1(OUT)

Not connected (* = marked no-connect by the designer): LED3 1(DO)*; U1 2(PC13)* 3(PC14-OSC32_IN)* 4(PC15-OSC32_OUT)* 8(PC0)* 9(PC1)* 10(PC2)* 11(PC3)* 12(PA0)* 13(PA1)* 14(PA2)* 17(PA3)* 22(PC4)* 23(PC5)* 30(PB10)* 38(PC6)* 39(PC7)* 40(PC8)* 41(PC9)* 51(PA15)* 55(PD2)* 56(PB3)* 57(PB4)* 58(PB5)* 59(PB6)* 60(PB7)* 62(PB9)*; U12 5(NC)* 7(NC)* 8(NC)* 21(NC)*

## Notes on the sheet
- 参数列表:
  VCC_Input = 24V
  NMOS: HYG053N10NS1C2
  100V/95A 4.6mohm@10V(GS)
- 参数计算：
  控制器频率：电流环：20kHz；速度环：1KHz；位置环：100Hz
  =>电流环每个loop只有50us所有的mosfet反应得小于这个参数
- VGS
- 24V电压输入
- 24V->10V
- VGS10V->5V
- 5V->3.3V
- 下载
- MCU滤波
- 状态指示灯
- 电源滤波
- GND隔离
- SPI编码器
- 3.3V指示灯
- 10V->5V
- 电流采样
- 逆变电路
- 栅极驱动芯片
- 总线采样
- CAN接收发送
- 24V->10V VGS
- 主控
